# EAGLE design senseye-2_temple (EAGLE 6.5.0)
AUTHOR: Neal Jackson; REV: A; TITLE: SensEye-2_temple
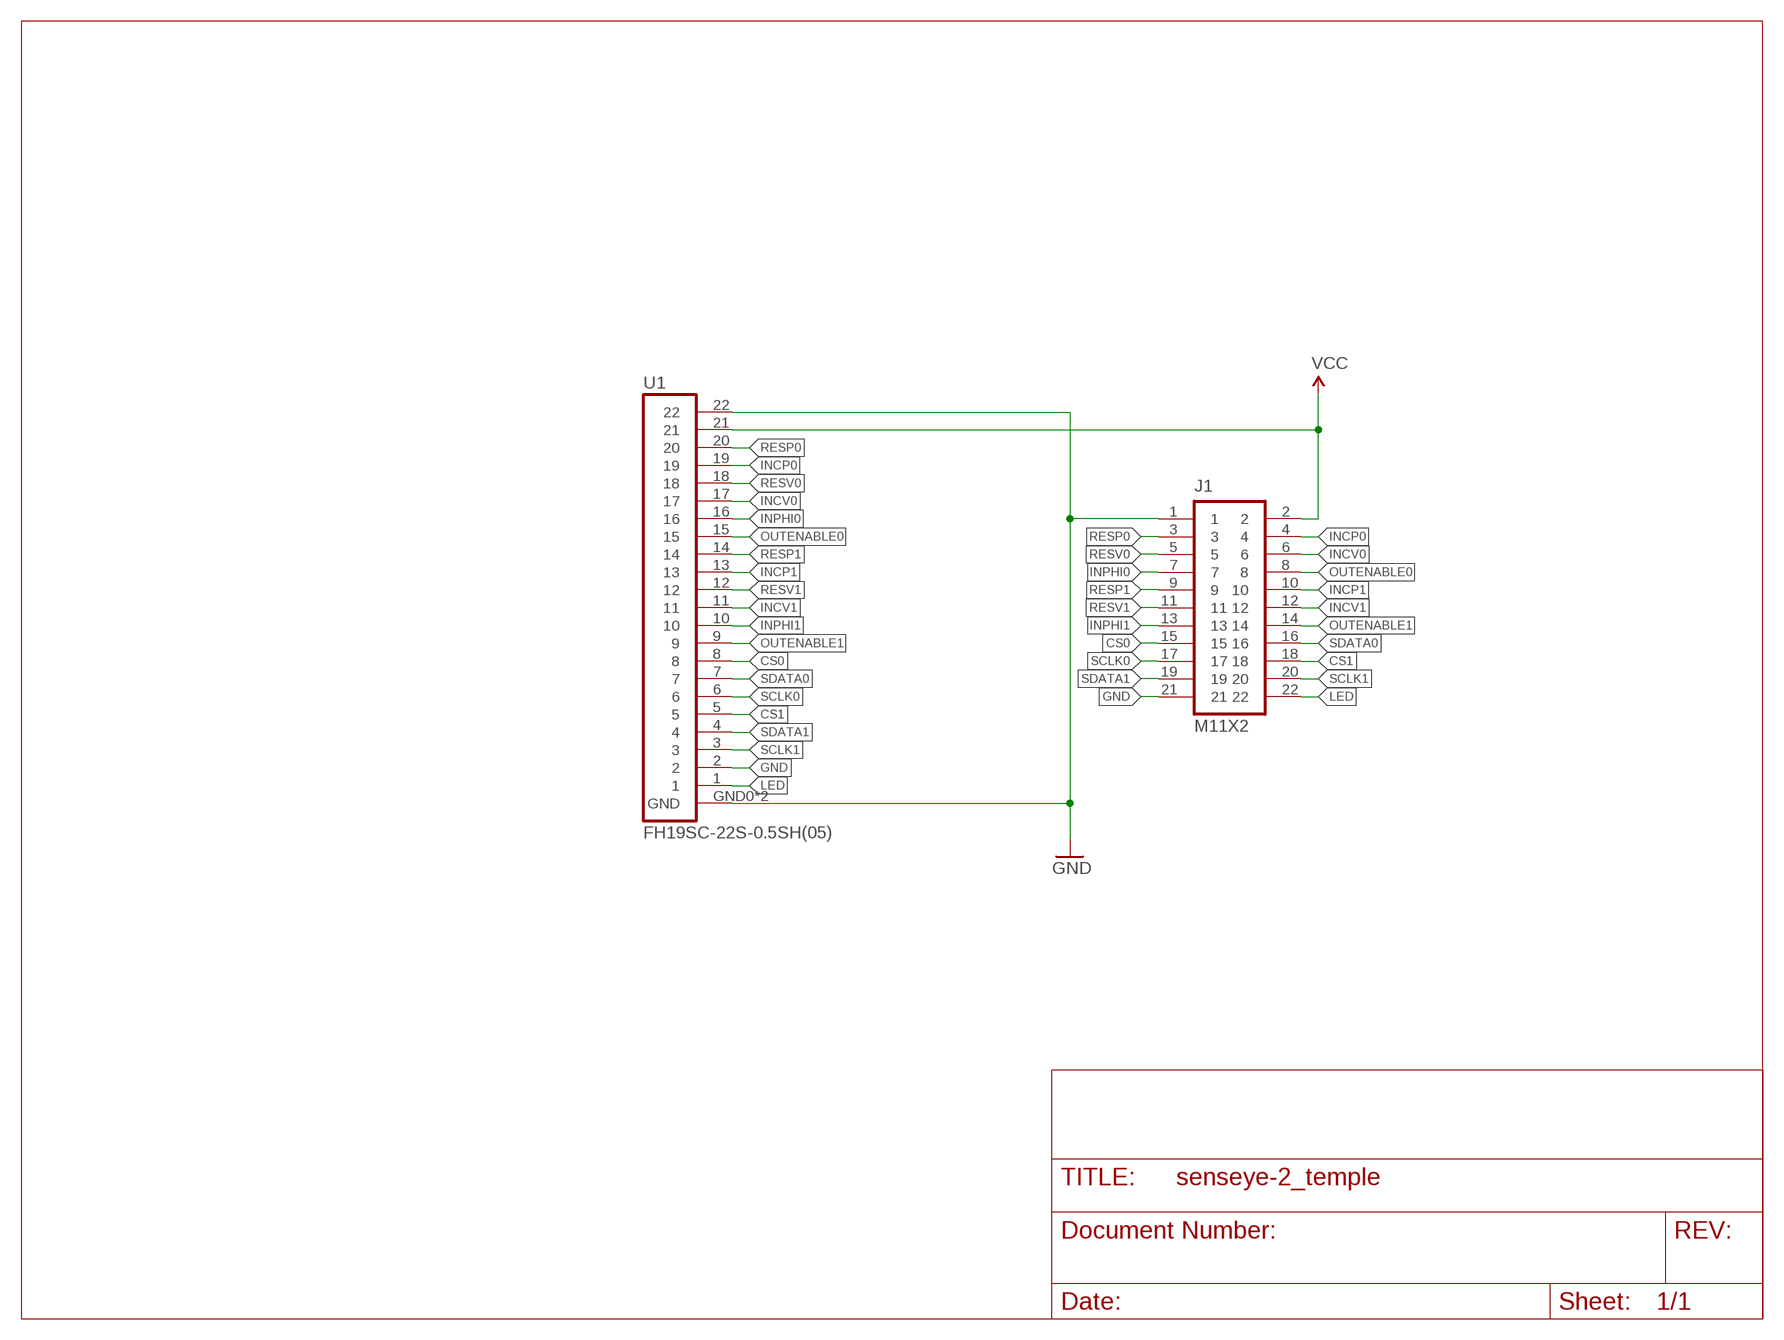
[diagram p0: schematic, sheet 1]

## Parts
J1  M11X2  [2X11]
U1  FH19SC-22S-0.5SH(05)  [FH19SC-22S-0.5SH(05)]

## Nets
CS0: J1.15 U1.8
CS1: J1.18 U1.5
GND: J1.1 J1.21 U1.2 U1.22 U1.GND0(GND) U1.GND1(GND)
INCP0: J1.4 U1.19
INCP1: J1.10 U1.13
INCV0: J1.6 U1.17
INCV1: J1.12 U1.11
INPHI0: J1.7 U1.16
INPHI1: J1.13 U1.10
LED: J1.22 U1.1
OUTENABLE0: J1.8 U1.15
OUTENABLE1: J1.14 U1.9
RESP0: J1.3 U1.20
RESP1: J1.9 U1.14
RESV0: J1.5 U1.18
RESV1: J1.11 U1.12
SCLK0: J1.17 U1.6
SCLK1: J1.20 U1.3
SDATA0: J1.16 U1.7
SDATA1: J1.19 U1.4
VCC: J1.2 U1.21

## Library data of the parts
J1 = senseye-2:M11X2: This was SPECIALLY designed to be used with our Graphic LCD Backpack. Be sure you want to use this! It is not only staggered on each line of header holes, but IT IS ALSO offset of the center point of the top and bottom lines by 5 mil. This causes the headers to lock into place on the "standard" footprint on the LCD screen. The extra squares on the tdocu layer are there simply to reference other pins (if you were to actually populate a longer header than ten long - this is what we do with the backpacks).
U1 = senseye-2:FH19SC-22S-0.5SH(05)

## Board
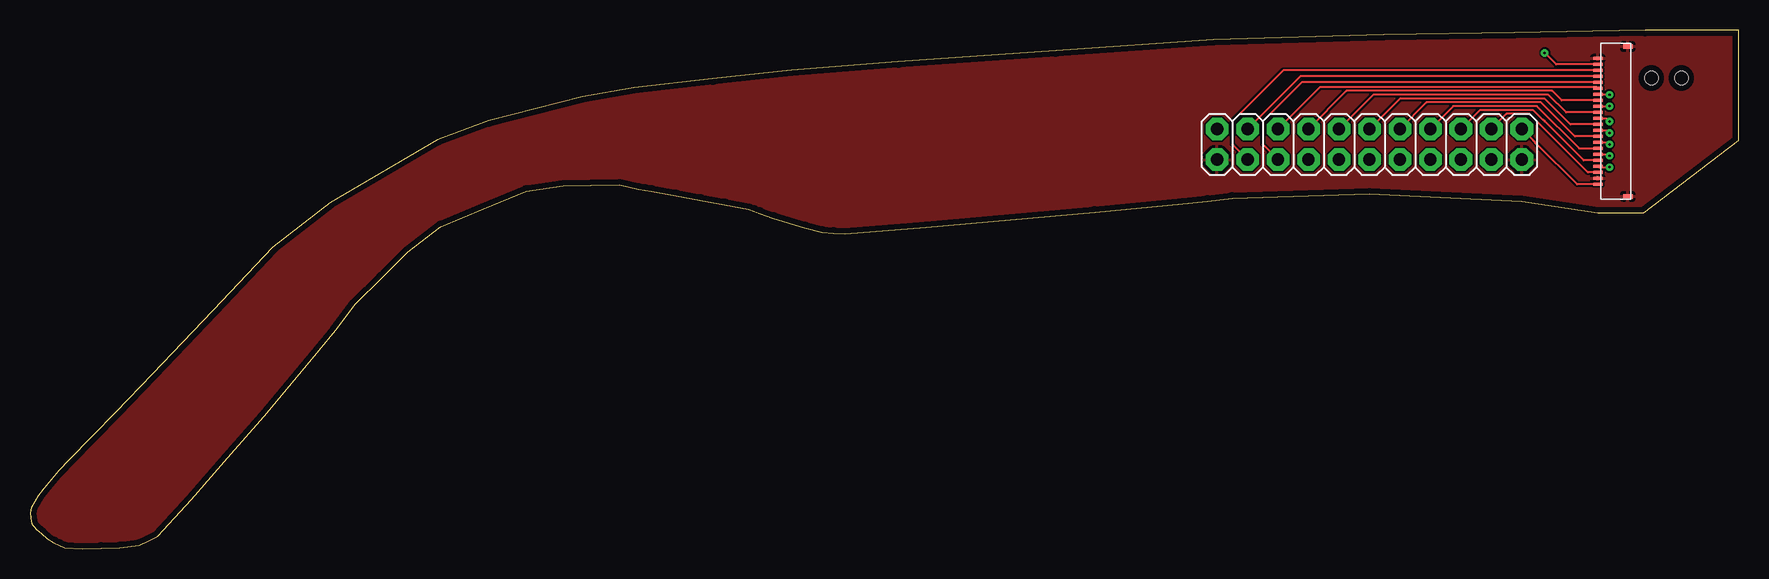
[diagram p1: board, top side]
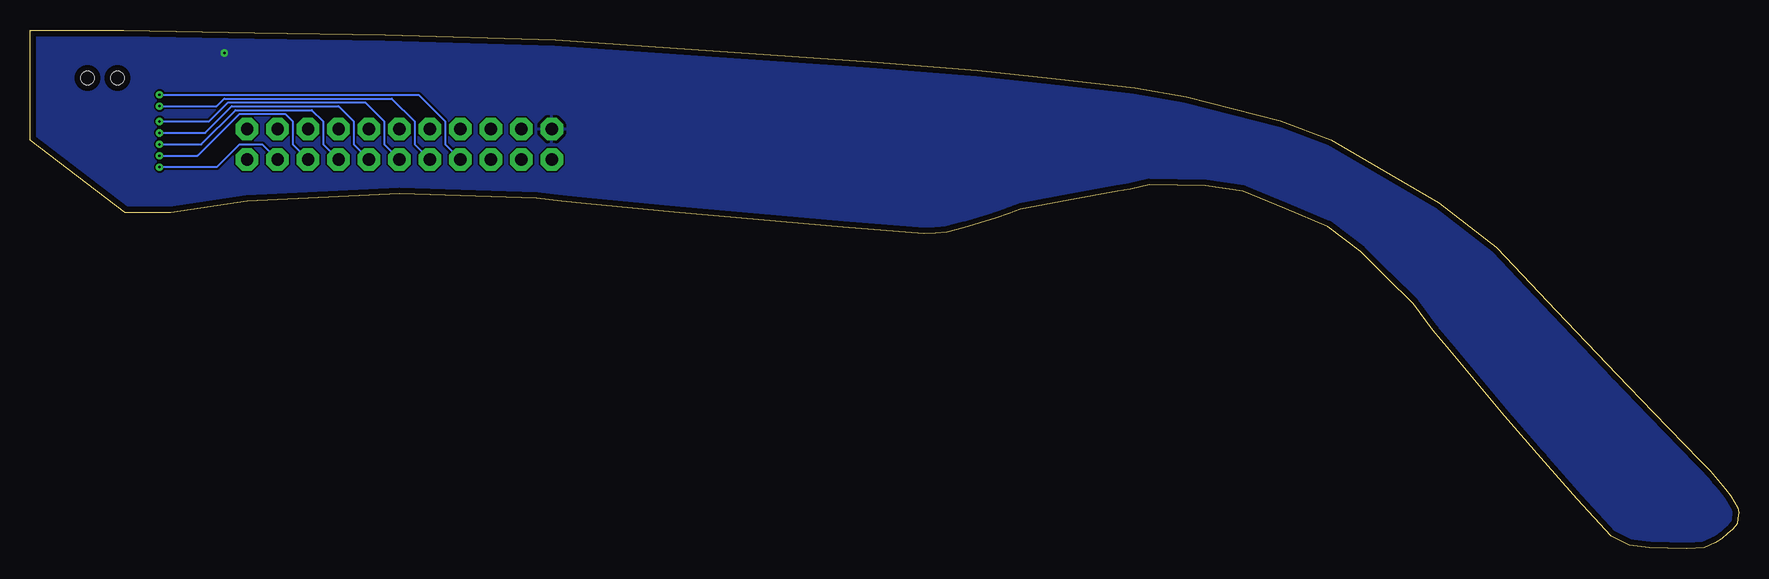
[diagram p2: board, bottom side, seen from below]

Size 142.45 x 43.24 mm. Coordinates in mm from the lower left corner, seen from the top.
Outline: 142.45,43.24 134.63,43.21 123.73,43.03 112.83,42.84 98.65,42.43 85.5,41.51 72.36,40.58 63.49,39.88 56.91,39.16 50.34,38.43 46.07,37.69 42.14,36.68 38.21,35.66 33.99,34.1 25,28.84 20.24,25.14 15.21,19.84 10.18,14.54 7.14,11.4 3.25,7.37 2.4,6.5 1.76,5.75 1.13,5 0.67,4.42 0.39,3.92 0.1,3.42 0,2.99 0.08,2.53 0.15,2.08 0.52,1.63 0.98,1.24 1.43,0.86 1.98,0.53 2.43,0.31 2.88,0.09 4.36,0 5.92,0.05 7.48,0.11 9.12,0.3 9.88,0.67 10.64,1.03 13.49,4.14 16.49,7.59 19.5,11.04 22.67,14.83 24.09,16.53 25.5,18.23 27.15,20.44 29.34,22.6 31.52,24.75 34.25,26.85 37.8,28.33 41.36,29.81 44.46,30.24 46.79,30.28 49.13,30.32 50.71,29.97 51.25,29.89 51.79,29.8 53.85,29.44 55.87,29.07 57.9,28.69 59.9,28.29 60.33,28.13 60.77,27.97 61.96,27.56 64.58,26.77 66.02,26.39 66.97,26.32 67.92,26.24 74.68,26.8 81.72,27.42 88.76,28.05 96.09,28.76 98.16,28.99 100.23,29.22 111.65,29.58 124.35,28.95 130.7,28 134.51,28 142.45,34.03 142.45,43.24
Copper layers (1*16): Top 0.0178mm / dielectric 59mil / Bottom 0.0178mm
Design rules "sunstone-2lyr_v1.0.0.3": minimum track width 6mil, minimum drill 14mil, track to track 6mil, track to pad 6mil, pad to pad 6mil, via to via 6mil, smd to smd 6mil, copper to edge 20mil, drill to drill 16mil, minimum pad ring 8mil, minimum via ring 8mil, stop-mask expansion 3mil, vias tented up to drill 50mil, thermal gap 10mil
Holes 1.1 mm at 137.65,39.24 135.15,39.24

### Footprints (pad centres in the part's own frame; a part is rotated, then mirrored left to right if it is on the bottom)
2X11 = drill 1.016 pad 1.88 octagon: 1 -11.43,-1.27; 2 -11.43,1.27; 3 -8.89,-1.27; 4 -8.89,1.27; 5 -6.35,-1.27; 6 -6.35,1.27; 7 -3.81,-1.27; 8 -3.81,1.27; 9 -1.27,-1.27; 10 -1.27,1.27; 11 1.27,-1.27; 12 1.27,1.27; 13 3.81,-1.27; 14 3.81,1.27; 15 6.35,-1.27; 16 6.35,1.27; 17 8.89,-1.27; 18 8.89,1.27; 19 11.43,-1.27; 20 11.43,1.27; 21 13.97,-1.27; 22 13.97,1.27
FH19SC-22S-0.5SH(05) = smd 0.25 x 0.8: 1 -5.25,0; 2 -4.75,0; 3 -4.25,0; 4 -3.75,0; 5 -3.25,0; 6 -2.75,0; 7 -2.25,0; 8 -1.75,0; 9 -1.25,0; 10 -0.75,0; 11 -0.25,0; 12 0.25,0; 13 0.75,0; 14 1.25,0; 15 1.75,0; 16 2.25,0; 17 2.75,0; 18 3.25,0; 19 3.75,0; 20 4.25,0; 21 4.75,0; 22 5.25,0 | smd 0.4 x 0.8: GND0 -6.25,-2.5; GND1 6.25,-2.5

### Placement (x,y rotation side)
J1  110.38,33.71 0 top
U1  130.7,35.62 90 top

### Tracks (layer width: path | path; a pad name or v marks a point on that pad's centre or on a via)
CS0  (via drill 0.2)
  Top 0.152: U1.8 131.5,33.87 v131.66,33.71
  Bottom 0.152: J1.15 118,33.71 118,35.62 118.96,36.57 125.31,36.57 128.16,33.71 v131.66,33.71
CS1
  Top 0.152: J1.18 120.86,36.57 125.31,36.57 126.1,35.78 126.26,35.62 129.51,32.37 U1.5
GND
  pour Top: 142.77,43.55 -0.11,43.55 -0.11,-0.26 142.77,-0.26
INCP0
  Top 0.152: U1.19 105.88,39.37 J1.4
INCP1
  Top 0.152: U1.13 128.05,36.37 126.58,37.84 111.97,37.84 J1.10
INCV0
  Top 0.152: J1.6 107.53,38.47 130.6,38.47 U1.17
INCV1
  Top 0.152: U1.11 128.41,35.37 126.26,37.52 114.19,37.52 J1.12
INPHI0  (via drill 0.2)
  Top 0.152: U1.16 131.63,37.87 v131.66,37.84
  Bottom 0.152: v131.66,37.84 110.07,37.84 107.84,35.62 107.84,33.71 J1.7
INPHI1  (via drill 0.2)
  Top 0.152: U1.10 131.45,34.87 v131.66,34.66
  Bottom 0.152: v131.66,34.66 127.85,34.66 125.62,36.89 116.73,36.89 115.46,35.62 115.46,33.71 J1.13
LED
  Top 0.152: J1.22 125.31,34.03 125.62,33.71 128.97,30.37 U1.1
OUTENABLE0
  Top 0.152: U1.15 127.68,37.37 126.89,38.16 109.75,38.16 J1.8
OUTENABLE1
  Top 0.152: U1.9 128.78,34.37 125.94,37.2 116.42,37.2 J1.14
RESP0
  Top 0.152: U1.20 104.47,39.87 100.22,35.62 100.22,33.71 J1.3
RESP1  (via drill 0.2)
  Top 0.152: U1.14 131.64,36.87 v131.66,36.89
  Bottom 0.152: v131.66,36.89 126.89,36.89 126.26,37.52 112.29,37.52 110.38,35.62 110.38,33.71 J1.9
RESV0
  Top 0.152: U1.18 106.01,38.87 102.76,35.62 102.76,33.71 J1.5
RESV1  (via drill 0.2)
  Top 0.152: U1.12 131.41,35.87 v131.66,35.62
  Bottom 0.152: v131.66,35.62 127.53,35.62 125.94,37.2 114.51,37.2 112.92,35.62 112.92,33.71 J1.11
SCLK0  (via drill 0.2)
  Top 0.152: U1.6 131.55,32.87 v131.66,32.76
  Bottom 0.152: J1.17 120.54,33.71 120.54,35.62 121.18,36.25 124.99,36.25 128.48,32.76 v131.66,32.76
SCLK1
  Top 0.152: J1.20 123.08,36.25 124.99,36.25 129.87,31.37 U1.3
SDATA0
  Top 0.152: J1.16 118.64,36.89 125.62,36.89 129.14,33.37 U1.7
SDATA1  (via drill 0.2)
  Top 0.152: U1.4 130.76,31.81 v131.66,31.81
  Bottom 0.152: J1.19 123.08,33.71 124.99,33.71 126.89,31.81 v131.66,31.81
VCC  (via drill 0.2)
  Top 0.152: U1.21 127.22,40.37 v126.26,41.33
  pour Bottom: -0.11,43.55 142.77,43.55 142.77,-0.26 -0.11,-0.26

### Text on the board
tDocu: VCC | IP0 | IV0 | OE0 | IP1 | IV1 | OE1 | SD0 | CS1 | SC1 | LED | GND | RP0 | RV0 | IPH0 | RP1 | RV1 | IPH1 | CS0 | SC0 | SD1 | GND